# Altium schematic sheet DisplayDriver.SchDoc
size A4
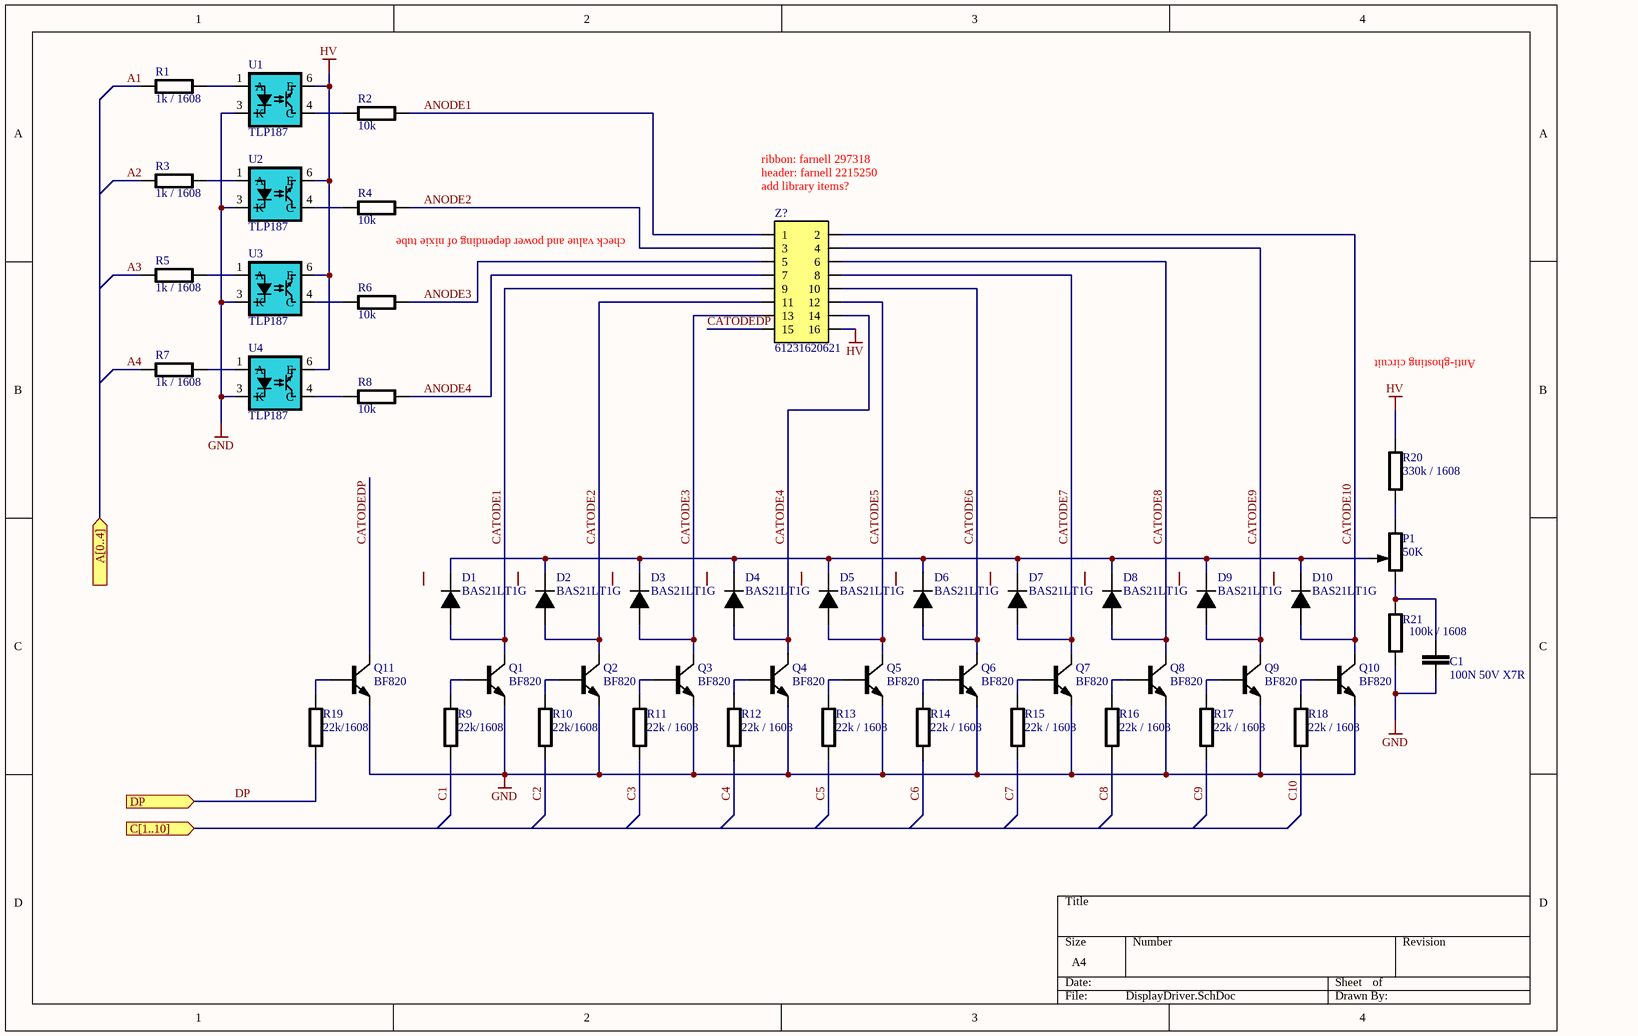
[diagram p0: DisplayDriver.SchDoc]

## Parts
C1  100N 50V X7R  [CAPC1608N]
D1  BAS21LT1G  [SOT95P230X124-3N]
D2  BAS21LT1G  [SOT95P230X124-3N]
D3  BAS21LT1G  [SOT95P230X124-3N]
D4  BAS21LT1G  [SOT95P230X124-3N]
D5  BAS21LT1G  [SOT95P230X124-3N]
D6  BAS21LT1G  [SOT95P230X124-3N]
D7  BAS21LT1G  [SOT95P230X124-3N]
D8  BAS21LT1G  [SOT95P230X124-3N]
D9  BAS21LT1G  [SOT95P230X124-3N]
D10  BAS21LT1G  [SOT95P230X124-3N]
P1  50K  [TRIM_3314J_BOURNS]
Q1  BF820  [SOT95P230X124-3N]
Q2  BF820  [SOT95P230X124-3N]
Q3  BF820  [SOT95P230X124-3N]
Q4  BF820  [SOT95P230X124-3N]
Q5  BF820  [SOT95P230X124-3N]
Q6  BF820  [SOT95P230X124-3N]
Q7  BF820  [SOT95P230X124-3N]
Q8  BF820  [SOT95P230X124-3N]
Q9  BF820  [SOT95P230X124-3N]
Q10  BF820  [SOT95P230X124-3N]
Q11  BF820  [SOT95P230X124-3N]
R1  1k / 1608  [RESC1608N]
R2  10k  [RESC2012N]
R3  1k / 1608  [RESC1608N]
R4  10k  [RESC2012N]
R5  1k / 1608  [RESC1608N]
R6  10k  [RESC2012N]
R7  1k / 1608  [RESC1608N]
R8  10k  [RESC2012N]
R9  22k/1608  [RESC1608N]
R10  22k/1608  [RESC1608N]
R11  22k / 1608  [RESC1608N]
R12  22k / 1608  [RESC1608N]
R13  22k / 1608  [RESC1608N]
R14  22k / 1608  [RESC1608N]
R15  22k / 1608  [RESC1608N]
R16  22k / 1608  [RESC1608N]
R17  22k / 1608  [RESC1608N]
R18  22k / 1608  [RESC1608N]
R19  22k/1608  [RESC1608N]
R20  330k / 1608  [RESC1608N]
R21  100k / 1608  [RESC1608N]
U1  TLP187  [SOP127P700X220-4_6N]
U2  TLP187  [SOP127P700X220-4_6N]
U3  TLP187  [SOP127P700X220-4_6N]
U4  TLP187  [SOP127P700X220-4_6N]
Z?  61231620621  [WE_61231620621]

## Ports
A[0..4] (in), C[1..10] (in), DP (in)

## Nets
GND: C1.2 Q1.2(E) Q2.2(E) Q3.2(E) Q4.2(E) Q5.2(E) Q6.2(E) Q7.2(E) Q8.2(E) Q9.2(E) Q10.2(E) Q11.2(E) R21.1 U1.3(K) U2.3(K) U3.3(K) U4.3(K)
HV: R20.1 U1.6(E) U2.6(E) U3.6(E) U4.6(E) Z?.16
A1: R1.1
A2: R3.1
A3: R5.2
A4: R7.1
ANODE1: R2.1 Z?.1
ANODE2: R4.1 Z?.3
ANODE3: R6.1 Z?.5
ANODE4: R8.1 Z?.7
C1: R9.2
C2: R10.1
C3: R11.2
C4: R12.2
C5: R13.2
C6: R14.1
C7: R15.2
C8: R16.2
C9: R17.2
C10: R18.1
CATODE1: D1.1(A) Q1.3(C) Z?.9
CATODE2: D2.1(A) Q2.3(C) Z?.11
CATODE3: D3.1(A) Q3.3(C) Z?.13
CATODE4: D4.1(A) Q4.3(C) Z?.14
CATODE5: D5.1(A) Q5.3(C) Z?.12
CATODE6: D6.1(A) Q6.3(C) Z?.10
CATODE7: D7.1(A) Q7.3(C) Z?.8
CATODE8: D8.1(A) Q8.3(C) Z?.6
CATODE9: D9.1(A) Q9.3(C) Z?.4
CATODE10: D10.1(A) Q10.3(C) Z?.2
CATODEDP: Q11.3(C) Z?.15
DP: R19.1 ; port DP
NetC1_1: C1.1 P1.1 R21.2
NetD1_3: D1.3(K) D2.3(K) D3.3(K) D4.3(K) D5.3(K) D6.3(K) D7.3(K) D8.3(K) D9.3(K) D10.3(K) P1.2
NetP1_3: P1.3 R20.2
NetQ1_1: Q1.1(B) R9.1
NetQ2_1: Q2.1(B) R10.2
NetQ3_1: Q3.1(B) R11.1
NetQ4_1: Q4.1(B) R12.1
NetQ5_1: Q5.1(B) R13.1
NetQ6_1: Q6.1(B) R14.2
NetQ7_1: Q7.1(B) R15.1
NetQ8_1: Q8.1(B) R16.1
NetQ9_1: Q9.1(B) R17.1
NetQ10_1: Q10.1(B) R18.2
NetQ11_1: Q11.1(B) R19.2
NetR1_2: R1.2 U1.1(A)
NetR2_2: R2.2 U1.4(C)
NetR3_2: R3.2 U2.1(A)
NetR4_2: R4.2 U2.4(C)
NetR5_1: R5.1 U3.1(A)
NetR6_2: R6.2 U3.4(C)
NetR7_2: R7.2 U4.1(A)
NetR8_2: R8.2 U4.4(C)

## Notes on the sheet
- ribbon: farnell 297318
- header: farnell 2215250
- (near R4) check value and power depending of nixie tube
- (near Z?) add library items?
- Anti-ghosting circuit

## Library data of the parts
C1 = CAP 1608 100N 50V 10% X7R: WALSIN - 0603B104K500CT - CAPACITOR, MLCC, X7R, 0.1UF, 50V, 0603; Initial Voltage: 0; Dielectric Characteristic: X7; Value: 100n; Supplier 1: Farnell; Supplier Part Number 1: 2496834; Manufacturer Part Number: 0603B104K500CT; Manufacturer: WALSIN
D1-D10 = DIODE BAS21LT1G 250V 200MA SOT23-3: DIODE BAS21LT1G GEN PURP 250V 200MA SOT23; Manufacturer: ON Semiconductor; Package / Case: TO-236-3, SC-59, SOT-23-3; Manufacturer Part Number: BAS21LT1G; Supplier 1: Farnell; Supplier Part Number 1: 2394287
P1 = POT TRIM 50K 20% 3314 Series: BOURNS - 3314J-2-503E - TRIMMER, POT, 50KOHM, 20%, 1TURN, SMD; Manufacturer: BOURNS; Supplier 1: Farnell; Supplier Part Number 1: 2328519; Manufacturer Part Number: 3314J-2-503E; Value: 50k
Q1-Q11 = NPN BF820 300V 0.05A SOT23-3: NEXPERIA - BF820 - TRANSISTOR, NPN, SOT-23; Package / Case: TO-236-3, SC-59, SOT-23-3; Supplier 1: Farnell; Supplier Part Number 1: 1081284; Manufacturer Part Number: BF820; Manufacturer: NEXPERIA
R1 R3 R5 R7 = RES 1608 1K 1%: VISHAY - CRCW06031K00FKEA - RES, THICK FILM, 1K, 1%, 0.1W, 0603; Tolerance: ±1%; Value: 1k; Manufacturer: VISHAY; Supplier 1: Farnell; Supplier Part Number 1: 1469740; Manufacturer Part Number: CRCW06031K00FKEA
R2 R4 R6 R8 = RES 2012 10K 1%: RES SMD 10K OHM 1% 1/8W 0805; Manufacturer: Vishay Dale; Manufacturer Part Number: CRCW080510K0FKEA; Supplier 1: Farnell; Supplier Part Number 1: 1469856; Tolerance: ±1%; Value: 10k
R9-R19 = RES 1608 22K 1%: VISHAY - CRCW060322K0FKEA - RES, THICK FILM, 22K, 1%, 0.1W, 0603; Tolerance: ±1%; Value: 22k; Manufacturer: VISHAY; Supplier 1: Farnell; Supplier Part Number 1: 1469779; Manufacturer Part Number: CRCW060322K0FKEA
R20 = RES 1608 330K 1%: VISHAY - CRCW0603330KFKEA. - RES, THICK FILM, 330K, 1%, 0.1W, 0603; Tolerance: ±1%; Operating Temperature Range: -55°C to +155; Supplier 1: Farnell; Supplier Part Number 1: 2138547; Manufacturer Part Number: CRCW0603330KFKEA.; Manufacturer: VISHAY; Value: 330k
R21 = RES 1608 100K 1%: VISHAY - CRCW0603100KFKEA. - RES, THICK FILM, 100K, 1%, 0.1W, 0603; Supplier 1: Farnell; Supplier Part Number 1: 1469649; Manufacturer Part Number: CRCW0603100KFKEA.; Manufacturer: VISHAY; Value: 100k
U1-U4 = IC OPTOCOUPLER TLP187: TOSHIBA - TLP187 - OPTOCOUPLER, DARLINGTON, 3.75KV, SMDIP-4; Revision: 17-Jul-2002: Re-released for DXP Platform.; Supplier 1: Farnell; Supplier Part Number 1: 2524263; Manufacturer: TOSHIBA; Manufacturer Part Number: TLP187
Z? = HEADER 61231620621 2X8 2.54MM: WURTH ELEKTRONIK - 61231620621 - HEADER, 2.54MM, MALE, SMT, R/A, 16WAY; Supplier 1: Farnell; Supplier Part Number 1: 2356282; Manufacturer: WURTH ELEKTRONIK; Manufacturer Part Number: 61231620621